# EAGLE design ultra-violet-tooth-sensor-mk-3.1 (EAGLE 6.5.0)
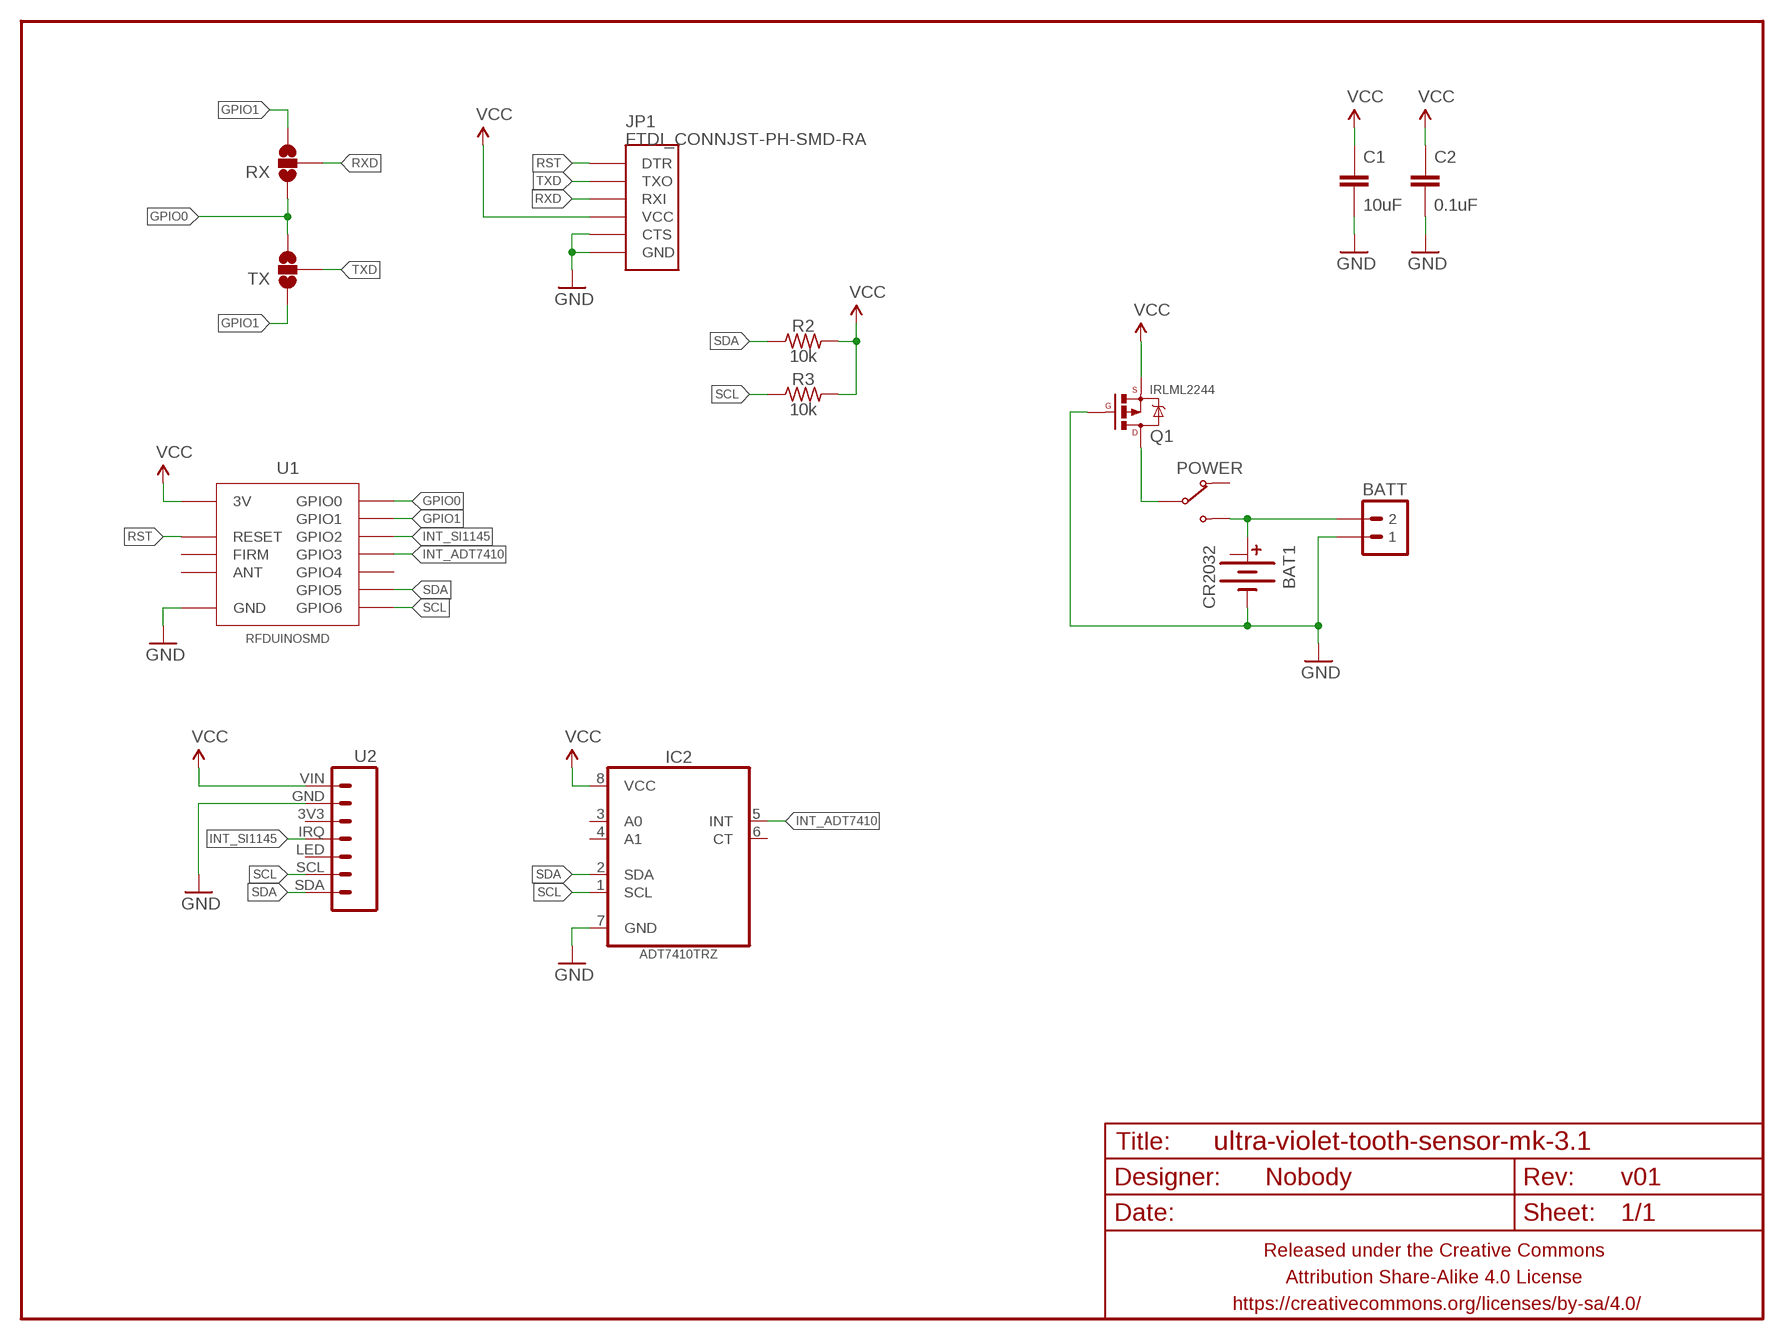
[diagram p0: schematic, sheet 1]

## Parts
BAT1  CR2032  BATTERY-COINCR2032_SMD_TIGHT  [BATTCON_20MM_MINE_STAHPIT]
BATT  M02PTH-CENTERED-R+  [1X02-CENTER-R+]
C1  10uF  CAPACITOR-CERAMICC1206  [C1206]
C2  0.1uF  CAPACITOR-CERAMICC0805  [C0805]
FRAME1  FRAME-LETTERNO_PACKAGE  [DUMMY]
IC2  ADT7410TRZ  ADT7410TRZSOIC8N  [SOIC127P600X175-8N]
JP1  FTDI_CONNJST-PH-SMD-RA  [AVRISP-JST-6-PH-RA-SMD]
POWER  SWITCH-SPDTPTH-RA-2.54MM  [SPDT-RA-2.54MM]
Q1  IRLML2244  MOSFET-PCHANNELIRLML2244  [SOT23-3]
R2  10k  RESISTORR0805  [R0805]
R3  10k  RESISTORR0805  [R0805]
RX  JUMPER-PAD-3-NOFULL_BOX_SILK  [PAD-JUMPER-3-NO_YES_SILK_FULL_BOX]
TX  JUMPER-PAD-3-NOFULL_BOX_SILK  [PAD-JUMPER-3-NO_YES_SILK_FULL_BOX]
U1  RFDUINOSMD  [RFDUINO-SMD]
U2  ADAFRUIT-SI1145-BREAKOUTSMTLULZ  [ADAFRUIT-SI1145-BREAKOUT-SMTLULZ]

## Nets
GND: BAT1.BOTTOM(-) BATT.1 C1.2 C2.2 IC2.7(GND) JP1.CTS JP1.GND Q1.1(G) U1.GND@1(GND) U1.GND@2(GND) U1.GND@3(GND) U1.GND@4(GND) U1.GND@5(GND) U1.GND@6(GND) U1.GND@7(GND) U1.GND@8(GND)
GPIO0: RX.1 TX.3 U1.GPIO0
GPIO1: RX.3 TX.1 U1.GPIO1
INT_ADT7410: IC2.5(INT) U1.GPIO3
INT_SI1145: U1.GPIO2
N$1: BAT1.TOP@1(+) BATT.2 POWER.3(NO)
N$2: POWER.2(COM) Q1.3(D)
RST: JP1.DTR U1.RESET
RXD: JP1.RXI RX.2
SCL: IC2.1(SCL) R3.1 U1.GPIO6
SDA: IC2.2(SDA) R2.1 U1.GPIO5
TXD: JP1.TXO TX.2
VCC: C1.1 C2.1 IC2.8(VCC) JP1.VCC Q1.2(S) R2.2 R3.2 U1.3V
Unconnected: BAT1.TOP@2(+1) IC2.3(A0) IC2.4(A1) IC2.6(CT) POWER.1(NC) U1.ANT U1.FACTORY(FIRM) U1.GPIO4 U2.3V3(3V3_OUT) U2.GND U2.IRQ U2.LED U2.SCL U2.SDA U2.VIN

## Library data of the parts
BAT1 = A_butts:BATTERY-COIN
BATT = A_butts:M02: Standard 2-pin 0.1" header. Use with - straight break away headers ( PRT-00116) - right angle break away headers (PRT-00553) - swiss pins (PRT-00743) - machine pins (PRT-00117) - female headers (PRT-00115) Molex polarized connector foot print use with: PRT-08233 with associated crimp pins and housings. 2.54_SCREWTERM for use with PRT-10571. 3.5mm Screw Terminal footprints for PRT-08084 5mm Screw Terminal footprints for use with PRT-08433
C1 C2 = A_butts:CAPACITOR-CERAMIC: CAPACITOR, European symbol
FRAME1 = A_butts:FRAME-LETTER: Schematic Frame Standard 8.5x11 US Letter frame; DESIGNER: Nobody; VERSION: v01
IC2 = A_butts:ADT7410TRZ: I2C Temperature Sensor; MPN: ADT7410TRZ; OC_FARNELL: 2102534; OC_NEWARK: 08R6646; PACKAGE: SOIC-8; SUPPLIER: ANALOG DEVICES
JP1 = A_butts:FTDI_CONN: Connector which mates to FTDI basic or FTDI cable.
POWER = A_butts:SWITCH-SPDT
Q1 = A_butts:MOSFET-PCHANNEL: Generic PMOSFET IRLML2244 - TRANS-11153 (SOT-23 -20V -4.3A) (1.Gate 2.Source 3.Drain) FQP27P06 - COM-10349 <http://www.sparkfun.com/products/10349> (TO-220 -60V -27A) (1.Gate 2.Source 3.Drain); PROD_ID: TRANS-11153
R2 R3 = A_butts:RESISTOR: RESISTOR, American symbol
RX TX = A_butts:JUMPER-PAD-3-NO
U1 = A_butts:RFDUINO
U2 = A_butts:ADAFRUIT-SI1145-BREAKOUT

## Board
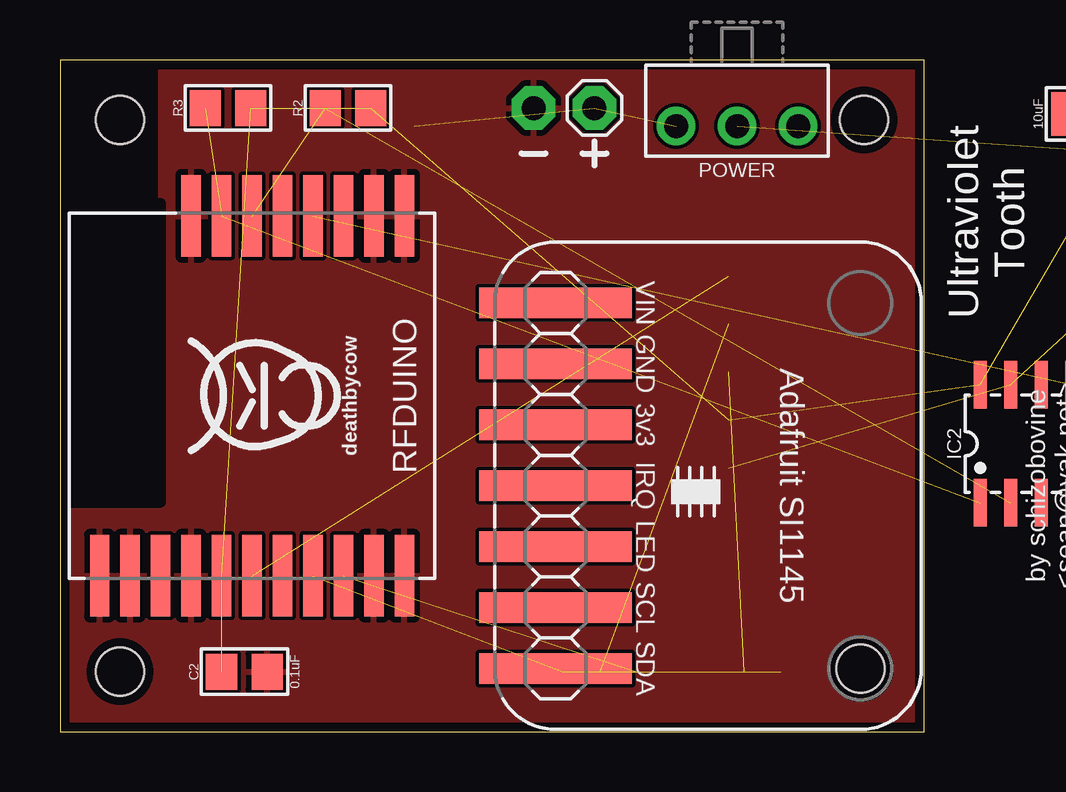
[diagram p1: board, top side]
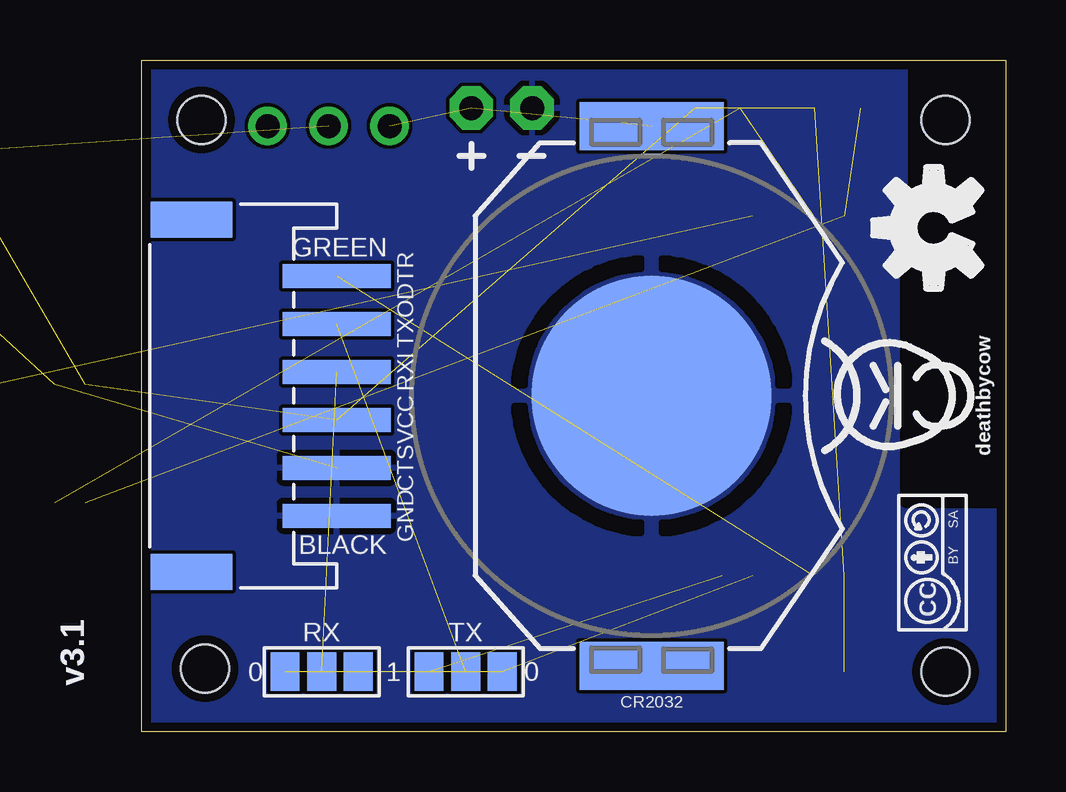
[diagram p2: board, bottom side, seen from below]

Size 36 x 28 mm. Coordinates in mm from the lower left corner, seen from the top.
Outline: 0,0 36,0 36,28 0,28 0,0
Copper layers (1*16): Top 0.0356mm / dielectric 1.5011mm / Bottom 0.0356mm
Design rules "LaenPCBOrder_2": minimum track width 6mil, minimum drill 13mil, track to track 6mil, track to pad 6mil, pad to pad 6mil, via to via 6mil, smd to smd 6mil, copper to edge 15mil, drill to drill 6mil, minimum pad ring 7mil, minimum via ring 7mil, stop-mask expansion 3mil, vias tented up to drill 20mil, thermal gap 10mil
Holes 2 mm at 2.5,25.5 2.5,2.5 33.5,25.5 33.36,2.62

### Footprints (pad centres in the part's own frame; a part is rotated, then mirrored left to right if it is on the bottom)
BATTCON_20MM_MINE_STAHPIT = smd 10 x 10: BOTTOM 0,0 | smd 6 x 2: TOP@1 0,11.25; TOP@2 0,-11.25
1X02-CENTER-R+ = drill 1 pad 1.8 octagon: 1 -1.27,0; 2 1.27,0
C1206 = smd 1.6 x 1.8: 1 -1.4,0; 2 1.4,0
C0805 = smd 1.3 x 1.5: 1 -0.95,0; 2 0.95,0
SOIC127P600X175-8N = smd 1.981 x 0.559: 1 -2.464,1.905; 2 -2.464,0.635; 3 -2.464,-0.635; 4 -2.464,-1.905; 5 2.464,-1.905; 6 2.464,-0.635; 7 2.464,0.635; 8 2.464,1.905
AVRISP-JST-6-PH-RA-SMD = smd 1 x 4.5: CTS -3,0; DTR 5,0; GND -5,0; RXI 1,0; TXO 3,0; VCC -1,0 | smd 1.5 x 3.4: G@1 -7.35,6.05; G@2 7.35,6.05
SPDT-RA-2.54MM = drill 1 pad 1.6: 1 0,0; 2 2.54,0; 3 5.08,0
SOT23-3 = smd 0.8 x 0.9: 1 -0.95,-1; 2 0.95,-1; 3 0,1.1
R0805 = smd 1.3 x 1.5: 1 -0.95,0; 2 0.95,0
PAD-JUMPER-3-NO_YES_SILK_FULL_BOX = smd 1.2 x 1.6: 1 -1.524,0; 2 0,0; 3 1.524,0
RFDUINO-SMD = smd 3.4 x 0.8: 3V 7.5,-1.27; ANT 7.5,-3.81; FACTORY 7.5,1.27; GND@1 -7.5,6.35; GND@2 -7.5,5.08; GND@3 -7.5,-2.54; GND@4 7.5,-6.35; GND@5 7.5,-5.08; GND@6 7.5,-2.54; GND@7 7.5,5.08; GND@8 7.5,6.35; GPIO0 7.5,2.54; GPIO1 7.5,3.81; GPIO2 -7.5,3.81; GPIO3 -7.5,2.54; GPIO4 -7.5,1.27; GPIO5 -7.5,0; GPIO6 -7.5,-1.27; RESET 7.5,0
ADAFRUIT-SI1145-BREAKOUT-SMTLULZ = smd 1.27 x 6.35: 3V3 -2.54,-6.35; GND -5.08,-6.35; IRQ 0,-6.35; LED 2.54,-6.35; SCL 5.08,-6.35; SDA 7.62,-6.35; VIN -7.62,-6.35

### Placement (x,y rotation side)
BAT1  14.75,14 0 bottom
BATT  21,26 0 top
C1  43.5,25.75 180 top  (outside the outline)
C2  7.68,2.5 0 top
FRAME1  0,0 180 top
IC2  40.25,12 90 top
JP1  27.87,14 90 bottom
POWER  30.75,25.25 180 top
Q1  48.5,22.75 0 top  (outside the outline)
R2  12,26 0 top
R3  7,26 0 top
RX  28.5,2.5 0 bottom
TX  22.5,2.5 0 bottom
U1  8,14 270 top
U2  27,10.25 270 top
U$1  [CC-BY-SA-4.0-NO-URL]  3.05,7.05 90 bottom
U$2  [COW_SMALL]  5,14 90 bottom
U$5  [COW_SMALL]  8,14 90 top
U$6  [OSHWLOGO_SILKONLY]  3,21 90 bottom

### Tracks (layer width: path | path; a pad name or v marks a point on that pad's centre or on a via)
GND  (3 unrouted)
  pour Top (isolate 0.152, rank 6): 36.1,28.1 36.1,-0.1 -0.1,-0.1 -0.1,9.5 4.15,9.5 4.15,28.1
  pour Bottom (isolate 0.152, rank 6): 36.1,28.1 36.1,-0.1 -0.1,-0.1 -0.1,9.5 4.15,9.5 4.15,28.1
GPIO0  (2 unrouted)
GPIO1  (2 unrouted)
INT_ADT7410  (1 unrouted)
N$1  (2 unrouted)
N$2  (1 unrouted)
RST  (1 unrouted)
RXD  (1 unrouted)
SCL  (2 unrouted)
SDA  (2 unrouted)
TXD  (1 unrouted)
VCC  (7 unrouted)

### Text on the board
tPlace: Ultraviolet / Tooth | by schizobovine / <sean@yak.net>
bPlace: Ultraviolet Tooth | 0 | 1 | 0